# EAGLE schematic smart automation home (EAGLE 6.6.0)
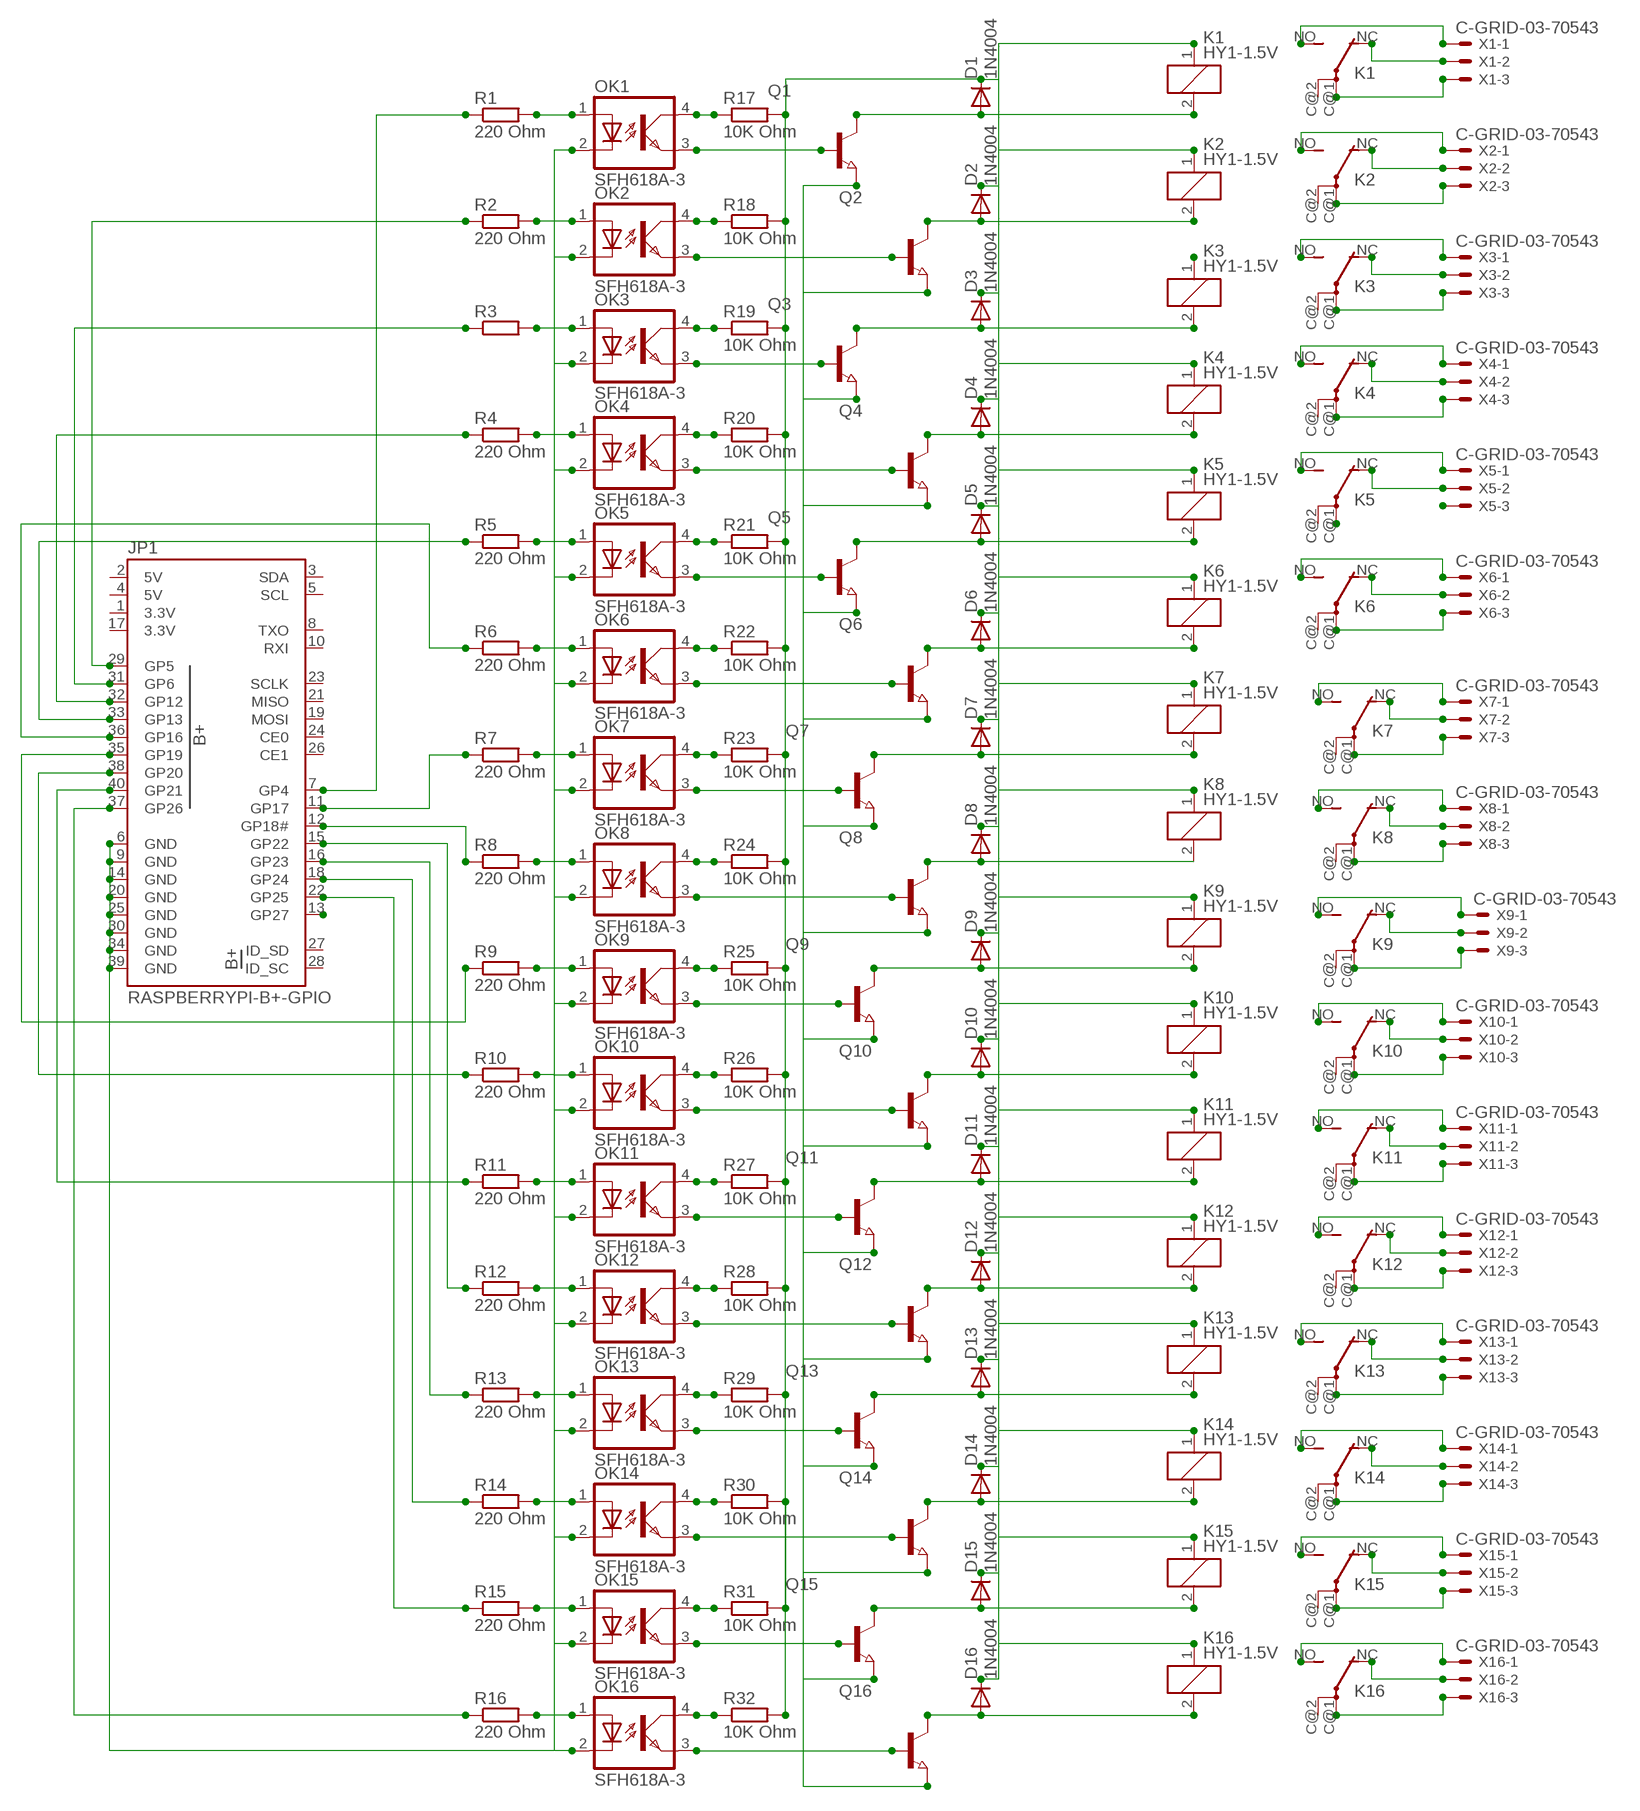
[diagram p0: schematic, sheet 1]

## Parts
D1  1N4004  [DO41-10]
D2  1N4004  [DO41-10]
D3  1N4004  [DO41-10]
D4  1N4004  [DO41-10]
D5  1N4004  [DO41-10]
D6  1N4004  [DO41-10]
D7  1N4004  [DO41-10]
D8  1N4004  [DO41-10]
D9  1N4004  [DO41-10]
D10  1N4004  [DO41-10]
D11  1N4004  [DO41-10]
D12  1N4004  [DO41-10]
D13  1N4004  [DO41-10]
D14  1N4004  [DO41-10]
D15  1N4004  [DO41-10]
D16  1N4004  [DO41-10]
JP1  RASPBERRYPI-B+-GPIO  [2X20-SHROUDED]
K1  HY1-1.5V  [HY]
K2  HY1-1.5V  [HY]
K3  HY1-1.5V  [HY]
K4  HY1-1.5V  [HY]
K5  HY1-1.5V  [HY]
K6  HY1-1.5V  [HY]
K7  HY1-1.5V  [HY]
K8  HY1-1.5V  [HY]
K9  HY1-1.5V  [HY]
K10  HY1-1.5V  [HY]
K11  HY1-1.5V  [HY]
K12  HY1-1.5V  [HY]
K13  HY1-1.5V  [HY]
K14  HY1-1.5V  [HY]
K15  HY1-1.5V  [HY]
K16  HY1-1.5V  [HY]
OK1  SFH618A-3  [DIP4]
OK2  SFH618A-3  [DIP4]
OK3  SFH618A-3  [DIP4]
OK4  SFH618A-3  [DIP4]
OK5  SFH618A-3  [DIP4]
OK6  SFH618A-3  [DIP4]
OK7  SFH618A-3  [DIP4]
OK8  SFH618A-3  [DIP4]
OK9  SFH618A-3  [DIP4]
OK10  SFH618A-3  [DIP4]
OK11  SFH618A-3  [DIP4]
OK12  SFH618A-3  [DIP4]
OK13  SFH618A-3  [DIP4]
OK14  SFH618A-3  [DIP4]
OK15  SFH618A-3  [DIP4]
OK16  SFH618A-3  [DIP4]
Q1  NPN-TRANSISTOR_SOT23  [SOT23]
Q2  NPN-TRANSISTOR_SOT23  [SOT23]
Q3  NPN-TRANSISTOR_SOT23  [SOT23]
Q4  NPN-TRANSISTOR_SOT23  [SOT23]
Q5  NPN-TRANSISTOR_SOT23  [SOT23]
Q6  NPN-TRANSISTOR_SOT23  [SOT23]
Q7  NPN-TRANSISTOR_SOT23  [SOT23]
Q8  NPN-TRANSISTOR_SOT23  [SOT23]
Q9  NPN-TRANSISTOR_SOT23  [SOT23]
Q10  NPN-TRANSISTOR_SOT23  [SOT23]
Q11  NPN-TRANSISTOR_SOT23  [SOT23]
Q12  NPN-TRANSISTOR_SOT23  [SOT23]
Q13  NPN-TRANSISTOR_SOT23  [SOT23]
Q14  NPN-TRANSISTOR_SOT23  [SOT23]
Q15  NPN-TRANSISTOR_SOT23  [SOT23]
Q16  NPN-TRANSISTOR_SOT23  [SOT23]
R1  220 Ohm  R-EU_M0805  [M0805]
R2  220 Ohm  R-EU_M0805  [M0805]
R3  R-EU_M0805  [M0805]
R4  220 Ohm  R-EU_M0805  [M0805]
R5  220 Ohm  R-EU_M0805  [M0805]
R6  220 Ohm  R-EU_M0805  [M0805]
R7  220 Ohm  R-EU_M0805  [M0805]
R8  220 Ohm  R-EU_M0805  [M0805]
R9  220 Ohm  R-EU_M0805  [M0805]
R10  220 Ohm  R-EU_M0805  [M0805]
R11  220 Ohm  R-EU_M0805  [M0805]
R12  220 Ohm  R-EU_M0805  [M0805]
R13  220 Ohm  R-EU_M0805  [M0805]
R14  220 Ohm  R-EU_M0805  [M0805]
R15  220 Ohm  R-EU_M0805  [M0805]
R16  220 Ohm  R-EU_M0805  [M0805]
R17  10K Ohm  R-EU_M0805  [M0805]
R18  10K Ohm  R-EU_M0805  [M0805]
R19  10K Ohm  R-EU_M0805  [M0805]
R20  10K Ohm  R-EU_M0805  [M0805]
R21  10K Ohm  R-EU_M0805  [M0805]
R22  10K Ohm  R-EU_M0805  [M0805]
R23  10K Ohm  R-EU_M0805  [M0805]
R24  10K Ohm  R-EU_M0805  [M0805]
R25  10K Ohm  R-EU_M0805  [M0805]
R26  10K Ohm  R-EU_M0805  [M0805]
R27  10K Ohm  R-EU_M0805  [M0805]
R28  10K Ohm  R-EU_M0805  [M0805]
R29  10K Ohm  R-EU_M0805  [M0805]
R30  10K Ohm  R-EU_M0805  [M0805]
R31  10K Ohm  R-EU_M0805  [M0805]
R32  10K Ohm  R-EU_M0805  [M0805]
X1  C-GRID-03-70543  [70543-03]
X2  C-GRID-03-70543  [70543-03]
X3  C-GRID-03-70543  [70543-03]
X4  C-GRID-03-70543  [70543-03]
X5  C-GRID-03-70543  [70543-03]
X6  C-GRID-03-70543  [70543-03]
X7  C-GRID-03-70543  [70543-03]
X8  C-GRID-03-70543  [70543-03]
X9  C-GRID-03-70543  [70543-03]
X10  C-GRID-03-70543  [70543-03]
X11  C-GRID-03-70543  [70543-03]
X12  C-GRID-03-70543  [70543-03]
X13  C-GRID-03-70543  [70543-03]
X14  C-GRID-03-70543  [70543-03]
X15  C-GRID-03-70543  [70543-03]
X16  C-GRID-03-70543  [70543-03]

## Nets
N$1: OK1.4(COL) R17.1
N$2: JP1.31(GP6) R3.1
N$4: K1.NC(2:O) X1.2
N$6: OK1.1(A) R1.2
N$7: K1.C@1(2:P) X1.3
N$8: D1.A K1.2 Q1.3(C)
N$9: JP1.33(GP13) R5.1
N$10: D2.A K2.2 Q2.3(C)
N$11: JP1.36(GP16) R6.1
N$13: K2.NO(2:S) X2.1
N$14: OK3.4(COL) R19.1
N$15: D3.A K3.2 Q3.3(C)
N$16: OK4.4(COL) R20.1
N$18: OK5.4(COL) R21.1
N$19: JP1.38(GP20) R10.1
N$20: D4.A K4.2 Q4.3(C)
N$22: OK6.4(COL) R22.1
N$23: OK2.1(A) R2.2
N$24: K3.1
N$25: OK3.1(A) R3.2
N$26: OK7.4(COL) R23.1
N$27: K2.C@1(2:P) X2.3
N$28: OK1.3(EMIT) Q1.1(B)
N$29: OK2.4(COL) R18.1
N$30: OK2.3(EMIT) Q2.1(B)
N$32: K3.NC(2:O) X3.2
N$33: OK4.1(A) R4.2
N$34: K3.C@1(2:P) X3.3
N$36: D5.A K5.2 Q5.3(C)
N$37: OK5.1(A) R5.2
N$38: OK8.4(COL) R24.1
N$39: D8.A K8.2 Q8.3(C)
N$41: OK6.1(A) R6.2
N$42: K4.NC(2:O) X4.2
N$43: K1.NO(2:S) X1.1
N$44: K4.C@1(2:P) X4.3
N$45: OK7.1(A) R7.2
N$46: OK9.4(COL) R25.1
N$48: OK7.3(EMIT) Q7.1(B)
N$49: OK8.1(A) R8.2
N$50: K5.NO(2:S) X5.1
N$51: K2.NC(2:O) X2.2
N$53: OK9.1(A) R9.2
N$55: OK9.3(EMIT) Q9.1(B)
N$56: OK10.4(COL) R26.1
N$59: OK10.1(A) R10.2
N$60: X5.3
N$61: OK11.4(COL) R27.1
N$63: OK11.1(A) R11.2
N$64: OK12.4(COL) R28.1
N$65: D16.A K16.2 Q16.3(C)
N$67: JP1.15(GP22) R12.1
N$68: K3.NO(2:S) X3.1
N$69: OK12.1(A) R12.2
N$70: OK13.4(COL) R29.1
N$72: OK12.3(EMIT) Q12.1(B)
N$74: OK14.4(COL) R30.1
N$75: OK13.1(A) R13.2
N$76: K4.NO(2:S) X4.1
N$78: K5.NC(2:O) X5.2
N$79: OK14.1(A) R14.2
N$80: OK15.4(COL) R31.1
N$82: K5.C@1(2:P)
N$84: OK16.4(COL) R32.1
N$86: K6.NO(2:S) X6.1
N$87: OK15.1(A) R15.2
N$88: D6.A K6.2
N$91: JP1.37(GP26) R16.1
N$93: OK16.1(A) R16.2
N$94: JP1.6(GND) JP1.9(GND) JP1.14(GND) JP1.20(GND) JP1.25(GND) JP1.30(GND) JP1.34(GND) JP1.39(GND) OK1.2(C) OK2.2(C) OK3.2(C) OK4.2(C) OK5.2(C) OK6.2(C) OK7.2(C) OK8.2(C) OK9.2(C) OK10.2(C) OK11.2(C) OK12.2(C) OK13.2(C) OK14.2(C) OK15.2(C) OK16.2(C)
N$95: K6.NC(2:O) X6.2
N$96: OK16.3(EMIT) Q16.1(B)
N$97: JP1.29(GP5) R2.1
N$98: D7.A K7.2 Q7.3(C)
N$99: JP1.32(GP12) R4.1
N$100: OK3.3(EMIT) Q3.1(B)
N$102: JP1.35(GP19) R9.1
N$103: K6.C@1(2:P) X6.3
N$104: JP1.40(GP21) R11.1
N$105: OK4.3(EMIT) Q4.1(B)
N$106: JP1.7(GP4) R1.1
N$107: JP1.11(GP17) R7.1
N$108: JP1.12(GP18#) R8.1
N$110: JP1.16(GP23) R13.1
N$111: JP1.18(GP24) R14.1
N$112: JP1.22(GP25) R15.1
N$113: JP1.13(GP27)
N$115: OK5.3(EMIT) Q5.1(B)
N$116: Q1.2(E) Q2.2(E) Q3.2(E) Q4.2(E) Q5.2(E) Q6.2(E) Q7.2(E) Q8.2(E) Q9.2(E) Q10.2(E) Q11.2(E) Q12.2(E) Q13.2(E) Q14.2(E) Q15.2(E) Q16.2(E)
N$117: Q6.3(C)
N$118: OK6.3(EMIT) Q6.1(B)
N$121: K9.NO(2:S) X9.1
N$122: K7.NO(2:S) X7.1
N$123: D9.A K9.2 Q9.3(C)
N$124: OK8.3(EMIT) Q8.1(B)
N$128: K7.NC(2:O) X7.2
N$129: D10.A K10.2 Q10.3(C)
N$130: OK10.3(EMIT) Q10.1(B)
N$133: OK11.3(EMIT) Q11.1(B)
N$135: D1.C D2.C D3.C D4.C D5.C D6.C D7.C D8.C D9.C D10.C D11.C D12.C D13.C D14.C D15.C D16.C K1.1 K2.1 K4.1 K5.1 K6.1 K7.1 K8.1 K9.1 K10.1 K11.1 K12.1 K13.1 K14.1 K15.1 K16.1 R17.2 R18.2 R19.2 R20.2 R21.2 R22.2 R23.2 R24.2 R25.2 R26.2 R27.2 R28.2 R29.2 R30.2 R31.2 R32.2
N$136: D11.A K11.2 Q11.3(C)
N$138: K12.NC(2:O) X12.2
N$139: OK13.3(EMIT) Q13.1(B)
N$141: K7.C@1(2:P) X7.3
N$142: OK14.3(EMIT) Q14.1(B)
N$143: D12.A K12.2 Q12.3(C)
N$145: OK15.3(EMIT) Q15.1(B)
N$148: K8.NO(2:S) X8.1
N$149: D13.A K13.2 Q13.3(C)
N$153: K8.NC(2:O) X8.2
N$154: D14.A K14.2 Q14.3(C)
N$156: K15.NC(2:O) X15.2
N$159: K8.C@1(2:P) X8.3
N$160: D15.A K15.2 Q15.3(C)
N$162: K9.NC(2:O) X9.2
N$166: K9.C@1(2:P) X9.3
N$167: K10.NO(2:S) X10.1
N$168: K10.NC(2:O) X10.2
N$169: K10.C@1(2:P) X10.3
N$170: K11.NO(2:S) X11.1
N$171: K11.NC(2:O) X11.2
N$172: K11.C@1(2:P) X11.3
N$173: K12.NO(2:S) X12.1
N$175: K12.C@1(2:P) X12.3
N$176: K13.NO(2:S) X13.1
N$177: K13.NC(2:O) X13.2
N$178: K13.C@1(2:P) X13.3
N$179: K14.NO(2:S) X14.1
N$180: K14.NC(2:O) X14.2
N$181: K14.C@1(2:P) X14.3
N$182: K15.NO(2:S) X15.1
N$184: K15.C@1(2:P) X15.3
N$185: K16.NO(2:S) X16.1
N$186: K16.NC(2:O) X16.2
N$187: K16.C@1(2:P) X16.3
Unconnected: JP1.3(SDA) JP1.5(SCL) JP1.8(TXO) JP1.10(RXI) JP1.19(MOSI) JP1.21(MISO) JP1.23(SCLK) JP1.24(CE0) JP1.26(CE1) JP1.27(ID_SD) JP1.28(ID_SC) K1.C@2(2:P) K2.C@2(2:P) K3.C@2(2:P) K4.C@2(2:P) K5.C@2(2:P) K6.C@2(2:P) K7.C@2(2:P) K8.C@2(2:P) K9.C@2(2:P) K10.C@2(2:P) K11.C@2(2:P) K12.C@2(2:P) K13.C@2(2:P) K14.C@2(2:P) K15.C@2(2:P) K16.C@2(2:P)

## Power pins joined to a net without a drawn wire
3.3V: JP1.1(3.3V) JP1.17(3.3V)
5V: JP1.2(5V) JP1.4(5V)

## Library data of the parts
D1-D16 = diode:1N4004: DIODE general purpose rectifier, 1 A
JP1 = SparkFun-Boards:RASPBERRYPI-B+-GPIO: Raspberry Pi B+ GPIO Header 2x20 pin connector
K1-K16 = relay:HY1*: Non-polarized 1 Form C Relay NAiS Source: http://www.mew-europe.com/.. en_ds_61012_0000.pdf; OC_FARNELL: unknown; OC_NEWARK: unknown
OK1-OK16 = optocoupler:SFH618?*: Optocoupler, Phototransistor Output, Low Input Current Source: Data sheet <http://www.vishay.com/docs/83673/sfh618.pdf>; MF: VISHAY/TELEFUNKEN; MPN: SFH618A-3; OC_FARNELL: 1020374; OC_NEWARK: 58K2209
Q1-Q16 = semicon-smd-ipc:NPN-TRANSISTOR_: NPN TRANSISTOR
R1-R32 = resistor:R-EU_: RESISTOR, European symbol
X1-X16 = con-molex:C-GRID-03: CONNECTOR wire to board 2.54 mm (0.100") pitch header; OC_FARNELL: unknown; OC_NEWARK: unknown